# EAGLE schematic eurorack-passive-diodefuzz-5switches (EAGLE 9.6.2)
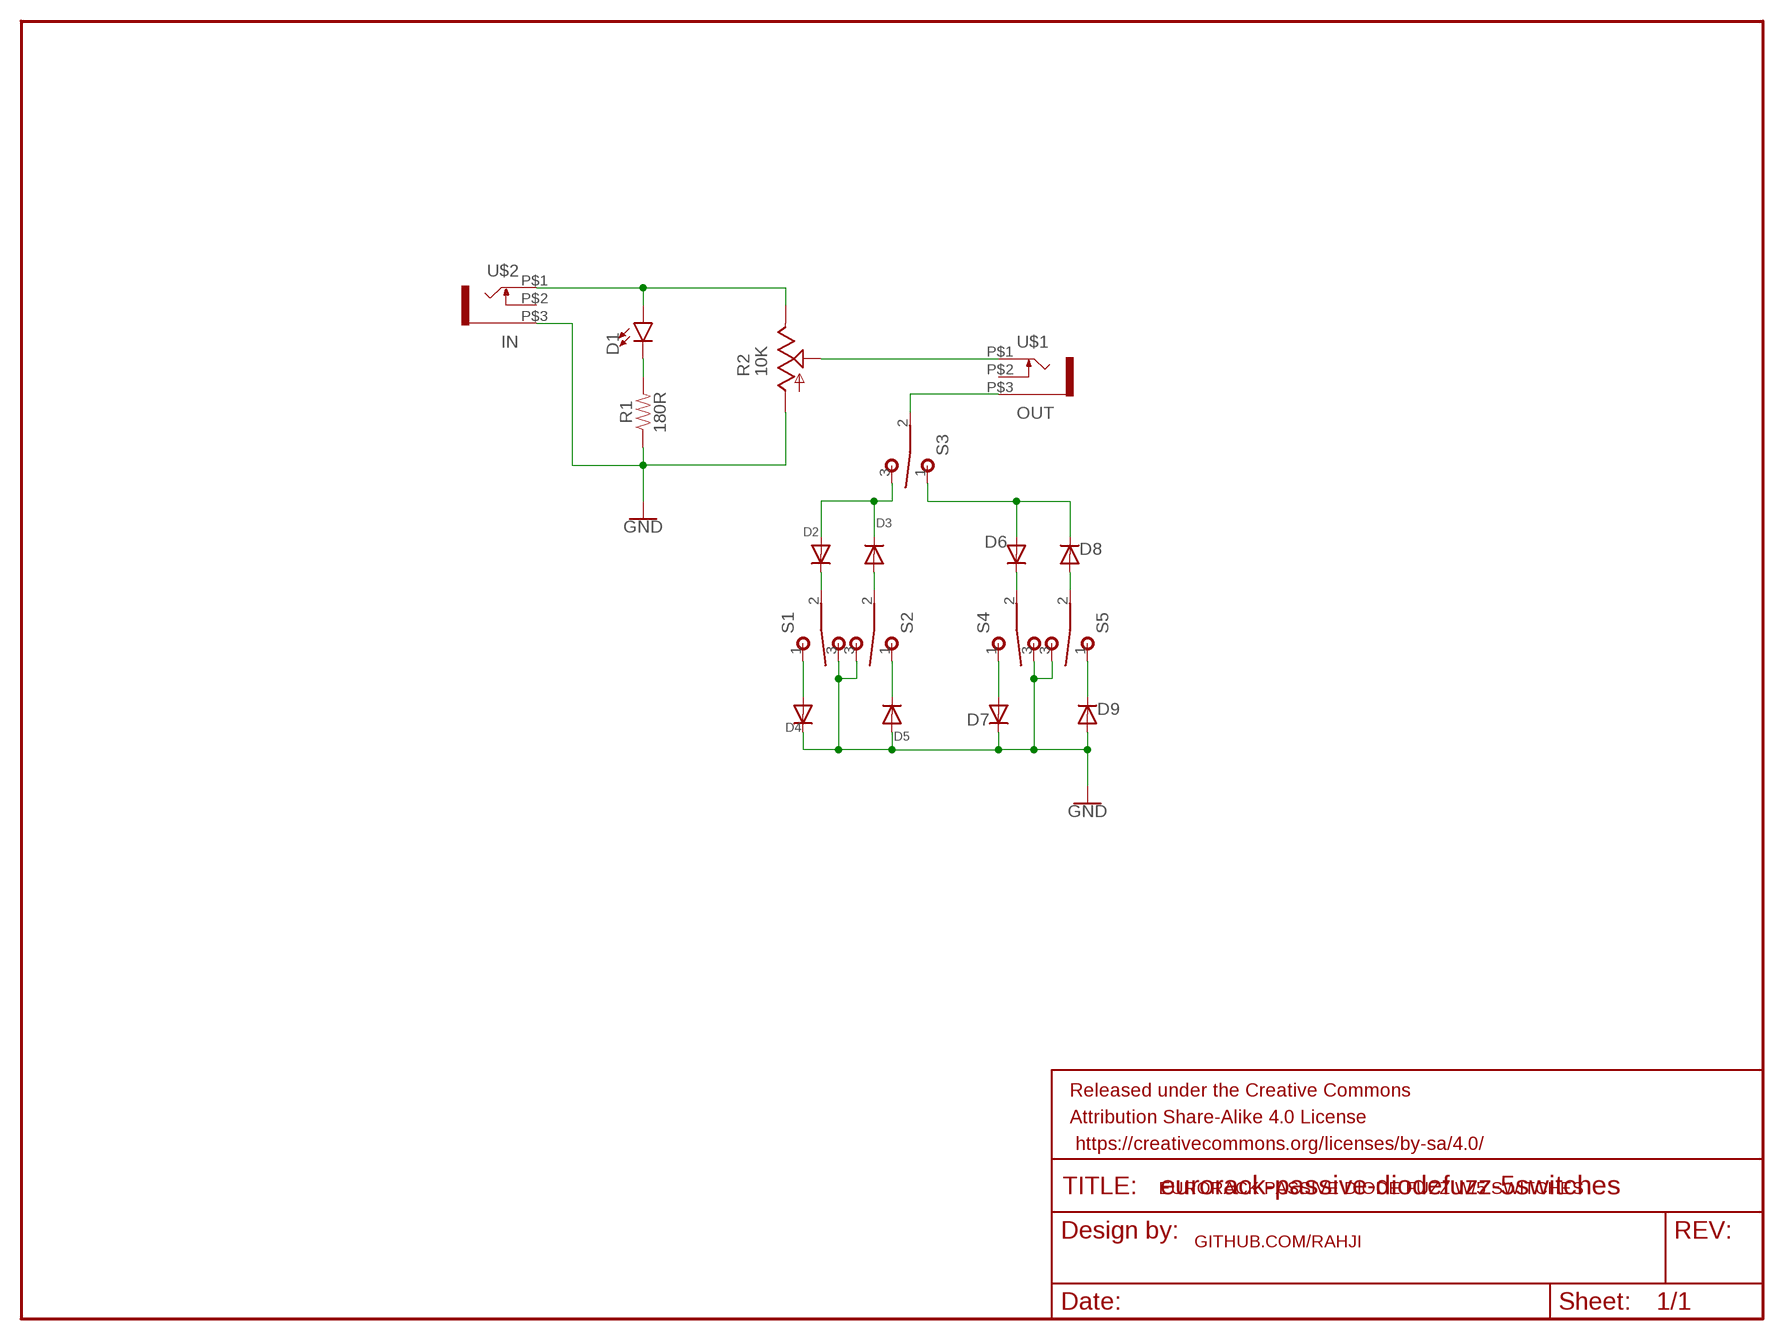
[diagram p0: schematic, sheet 1]

## Parts
D1  LED5MM  [LED_5MM]
D2  VERTICAL_DIODE  [C1702-05]
D3  VERTICAL_DIODE  [C1702-05]
D4  VERTICAL_DIODE  [C1702-05]
D5  VERTICAL_DIODE  [C1702-05]
D6  VERTICAL_DIODE  [C1702-05]
D7  VERTICAL_DIODE  [C1702-05]
D8  VERTICAL_DIODE  [C1702-05]
D9  VERTICAL_DIODE  [C1702-05]
FRAME1  FRAME-LETTERNO_PACKAGE  [DUMMY]
R1  180R  330OHM-HORIZ-1/10W-5%  [AXIAL-0.3]
R2  10K  ALPHA-9MMF3A  [EVUF]
S1  SPDT  [M9040P]
S2  SPDT  [M9040P]
S3  SPDT  [M9040P]
S4  SPDT  [M9040P]
S5  SPDT  [M9040P]
U$1  OUT  WQP-PJ301M-12_JACK  [WQP-PJ301M-12_JACK]
U$2  IN  WQP-PJ301M-12_JACK  [WQP-PJ301M-12_JACK]

## Nets
GND: D4.C D5.A D7.C D9.A R1.P$1 R2.1(A) S1.3(S) S2.3(S) S4.3(S) S5.3(S) U$2.P$3
N$1: D1.A R2.3(E) U$2.P$1
N$2: D1.K(C) R1.P$2
N$3: R2.2(S) U$1.P$1
N$4: S3.2(P) U$1.P$3
N$5: D2.A D3.C S3.3(S)
N$6: D2.C S1.2(P)
N$7: D3.A S2.2(P)
N$8: D4.A S1.1(O)
N$9: D6.C S4.2(P)
N$10: D5.C S2.1(O)
N$11: D8.A S5.2(P)
N$14: D6.A D8.C S3.1(O)
N$15: D7.A S4.1(O)
N$18: D9.C S5.1(O)
Unconnected: U$1.P$2 U$2.P$2

## Notes on the sheet
- EURORACK PASSIVE DIODE FUZZ W/5 SWITCHES
- GITHUB.COM/RAHJI

## Library data of the parts
D1 = SparkFun-LED:LED: LED (Generic) Standard schematic elements and footprints for 5mm, 3mm, 1206, and 0603 sized LEDs. Generic LEDs with no color specified.
D2-D9 = rahji:VERTICAL_DIODE
FRAME1 = SparkFun-Aesthetics:FRAME-LETTER: Schematic Frame - Letter Standard 8.5x11 US Letter frame; DESIGNER: Nobody; VERSION: v01
R1 = SparkFun-Resistors:330OHM: 330Ω resistor A resistor is a passive two-terminal electrical component that implements electrical resistance as a circuit element. Resistors act to reduce current flow, and, at the same time, act to lower voltage levels within circuits. - Wikipedia; PROD_ID: RES-8371; VALUE: 330
R2 = TomW:ALPHA-9MM: 9 mm Square Rotary Potentiometers Source: Panasonic
S1-S5 = TomW:SPDT: TOGGLE SWITCH Marquardt
U$1 U$2 = thonkiconn:WQP-PJ301M-12_JACK